# EAGLE design Adafruit_MAX31855 (EAGLE 5.01)
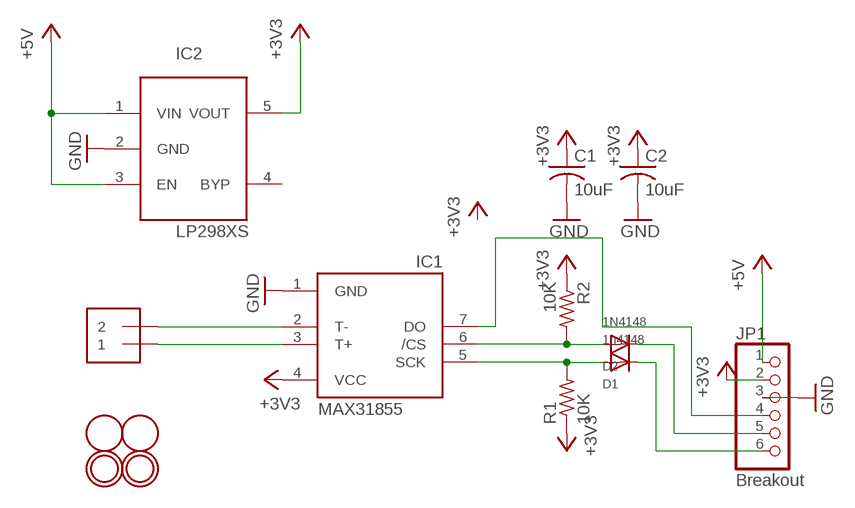
[diagram p0: schematic, sheet 1]

## Parts
C1  10uF  C-USC0805K  [C0805K]
C2  10uF  C-USC0805K  [C0805K]
D1  1n4148  DIODESOD-323F  [SOD-323F]
D2  1N4148  DIODESOD-323F  [SOD-323F]
IC1  MAX31855  MAX6675  [SO08]
IC2  LP298XS  [SOT23-5L]
J1  1X2-3.5MM  [1X2-3.5MM]
JP1  Breakout  HEADER-1X676MIL  [1X06_ROUND_76]
R1  10K  R-US_R0805  [R0805]
R2  10K  R-US_R0805  [R0805]
U$1  FIDUCIAL  [FIDUCIAL_1MM]
U$2  FIDUCIAL  [FIDUCIAL_1MM]
U$4  MOUNTINGHOLE2.0  [MOUNTINGHOLE_2.0_PLATED]
U$5  MOUNTINGHOLE2.0  [MOUNTINGHOLE_2.0_PLATED]

## Nets
+3V3: C1.1 C2.1 IC1.4(VCC) IC2.5(VOUT) JP1.2 R1.1 R2.1
+5V: IC2.1(VIN) IC2.3(EN) JP1.1
CS: D2.A IC1.6(/CS) R2.2
DO: IC1.7(DO) JP1.4
GND: C1.2 C2.2 IC1.1(GND) IC2.2(GND) JP1.3
N$1: IC1.3(T+) J1.1
N$2: D2.C JP1.5
N$3: D1.C JP1.6
N$4: IC1.2(T-) J1.2
SCK: D1.A IC1.5(SCK) R1.2
Unconnected: IC2.4(BYP)

## Library data of the parts
C1 C2 = adafruit:C-US: CAPACITOR, American symbol
D1 D2 = adafruit:DIODE: Diode SMADIODE - SMA Surface Mount Package 20V 1A Schottky Diode Digikey: 641-1014-6-ND DO-1N4148 - Through Hole Small Current Diode SOD-123 20V 1 A (.5mV Vf) Schottky Diode - Digikey: MBRX120TPMSCT-ND SOD-323 10V 570mA (.38mV Vf, 3ns) Schottky Diode - Digikey: ZLLS410CT-ND SOD-523 30V 30mA Schottky Diode (RB751S-40TE61) - Digikey: RB751S-40TE61CT-ND SOT23-R/W - SOT23 Package (R = Solder Paste/Reflow Ovens, W = Hand-Soldering) BAT54Film 40V 300mA - Digikey: 497-7162-1-ND
IC1 = adafruit:MAX6675
IC2 = adafruit:LP298X
J1 = adafruit:1X2: 3.5mm Terminal block http://www.ladyada.net/library/pcb/eaglelibrary.html
JP1 = microbuilder:HEADER-1X6: PIN HEADER
R1 R2 = adafruit:R-US_: RESISTOR, American symbol
U$1 U$2 = adafruit:FIDUCIAL: For use by pick and place machines to calibrate the vision/machine, 1mm By microbuilder.eu
U$4 U$5 = microbuilder:MOUNTINGHOLE: Mounting Hole

## Board
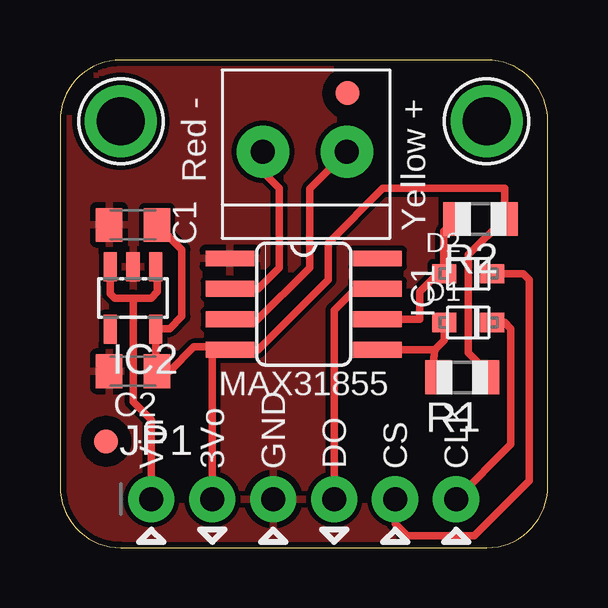
[diagram p1: board, top side]
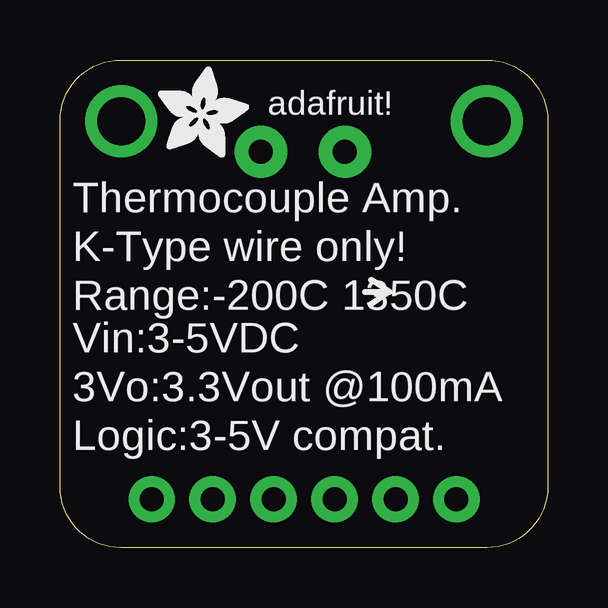
[diagram p2: board, bottom side, seen from below]

Size 20.33 x 20.32 mm. Coordinates in mm from the lower left corner, seen from the top.
Outline: 20.32,17.78 arc90 17.79,20.32 2.54,20.32 arc90 0,17.78 0,2.54 arc90 2.54,0 17.79,0 arc90 20.32,2.54 20.32,17.78
Copper layers (1*16): Top 0.035mm / dielectric 1.5mm / Bottom 0.035mm
Design rules "default": minimum track width 10mil, minimum drill 19mil, track to track 8mil, track to pad 8mil, pad to pad 8mil, via to via 8mil, smd to smd 8mil, copper to edge 10mil, drill to drill 8mil, minimum pad ring 10mil, minimum via ring 8mil, stop-mask expansion 4mil, vias tented up to drill 21mil, thermal gap 10mil

### Footprints (pad centres in the part's own frame; a part is rotated, then mirrored left to right if it is on the bottom)
C0805K = smd 1.1 x 1.4: 1 -1,0; 2 1,0
SOD-323F = smd 1 x 0.8: A -1,0; C 1,0
SO08 = smd 0.66 x 2.032: 1 -1.905,-3.073; 2 -0.635,-3.073; 3 0.635,-3.073; 4 1.905,-3.073; 5 1.905,3.073; 6 0.635,3.073; 7 -0.635,3.073; 8 -1.905,3.073
SOT23-5L = smd 0.55 x 1.2: 1 -0.95,-1.3; 2 0,-1.3; 3 0.95,-1.3; 4 0.95,1.3; 5 -0.95,1.3
1X2-3.5MM = drill 1 pad 2.184 round: 1 1.8,0; 2 -1.7,0
1X06_ROUND_76 = drill 1 pad 1.93 round: 1 -6.35,0; 2 -3.81,0; 3 -1.27,0; 4 1.27,0; 5 3.81,0; 6 6.35,0
R0805 = smd 1.1 x 1.4: 1 -1,0; 2 1,0
FIDUCIAL_1MM = smd 1 x 1: 1 0,0
MOUNTINGHOLE_2.0_PLATED = drill 2 pad 3 round: P$1 0,0

### Placement (x,y rotation side)
C1  3.04,13.45 180 top
C2  3.04,7.35 180 top
D1  17.01,9.39 0 top
D2  17.01,11.42 0 top
IC1  10.15,10.15 270 top
IC2  3.04,10.4 180 top
J1  10.15,16.5 0 top
JP1  10.15,2.02 0 top
R1  16.76,7.1 180 top
R2  17.52,13.7 180 top
U$1  11.98,18.94 0 top
U$2  1.93,4.43 0 top
U$4  17.78,17.77 0 top
U$5  2.54,17.77 0 top
U$6  [ADAFRUIT_3.5MM]  16.25,16.24 0 bottom

### Tracks (layer width: path | path; a pad name or v marks a point on that pad's centre or on a via)
+3V3
  Top 0.305: R1.1 17.78,7.35 17.01,8.12 17.01,12.2 R2.1 18.54,13.72 18.54,14.97 13.46,14.97 11.17,12.69 11.17,11.16 8.25,8.24 IC1.4 7.08,8.37 | 7.08,8.37 7.11,8.37 | 6.34,8.37 7.08,8.37 | 6.34,8.37 5.58,8.37 4.57,7.35 C2.1 | C2.1 3.81,7.35 | C2.1 4.04,7.59 4.06,7.61 3.99,7.67 IC2.5 4.02,9.13 4.57,9.13 5.08,9.64 5.08,12.42 C1.1 | JP1.2 6.34,8.37
+5V
  Top 0.305: IC2.3 2.09,10.59 2.28,10.4 3.04,10.4 | 3.04,10.4 3.81,10.4 4.06,10.66 4.06,11.42 4.02,11.67 IC2.1 | 3.04,10.4 3.04,6.08 3.81,5.32 JP1.1
CS
  Top 0.305: IC1.6 14.98,9.51 14.98,10.66 15.74,11.42 D2.A 16,11.43 16,13.18 R2.2
DO
  Top 0.305: JP1.4 11.42,9.89 12.44,10.91 13.46,10.91 13.33,10.78 IC1.7
GND
  pour Top: -0.26,20.31 -0.26,-0.27 20.82,-0.27 20.82,20.31
N$1
  Top 0.305: J1.1 10.41,14.95 10.41,11.67 8.12,9.39 7.11,9.39 7.11,9.49 IC1.3
N$2
  Top 0.305: D2.C 19.3,11.42 19.55,11.16 19.55,2.78 17.27,0.5 14.47,0.5 13.96,1 JP1.5
N$3
  Top 0.305: D1.C 18.54,9.39 18.79,9.13 18.79,4.31 JP1.6
N$4
  Top 0.305: IC1.2 8.25,10.78 9.14,11.67 9.14,14.97 8.38,15.74 8.38,16.5 J1.2
SCK
  Top 0.305: R1.2 15.49,7.1 15.62,8.24 | 15.62,8.24 IC1.5 | D1.A 16.01,8.64 15.62,8.24

### Text on the board
tPlace: Red - | Yellow + | MAX31855 | Vin | 3Vo | GND | DO | CS | CLK
bPlace: adafruit! | Thermocouple Amp. | K-Type wire only! | Range:-200C 1350C | Vin:3-5VDC | 3Vo:3.3Vout @100mA | Logic:3-5V compat.